# EAGLE schematic solar_collector_controller_V1.21 (EAGLE 6.5.0)
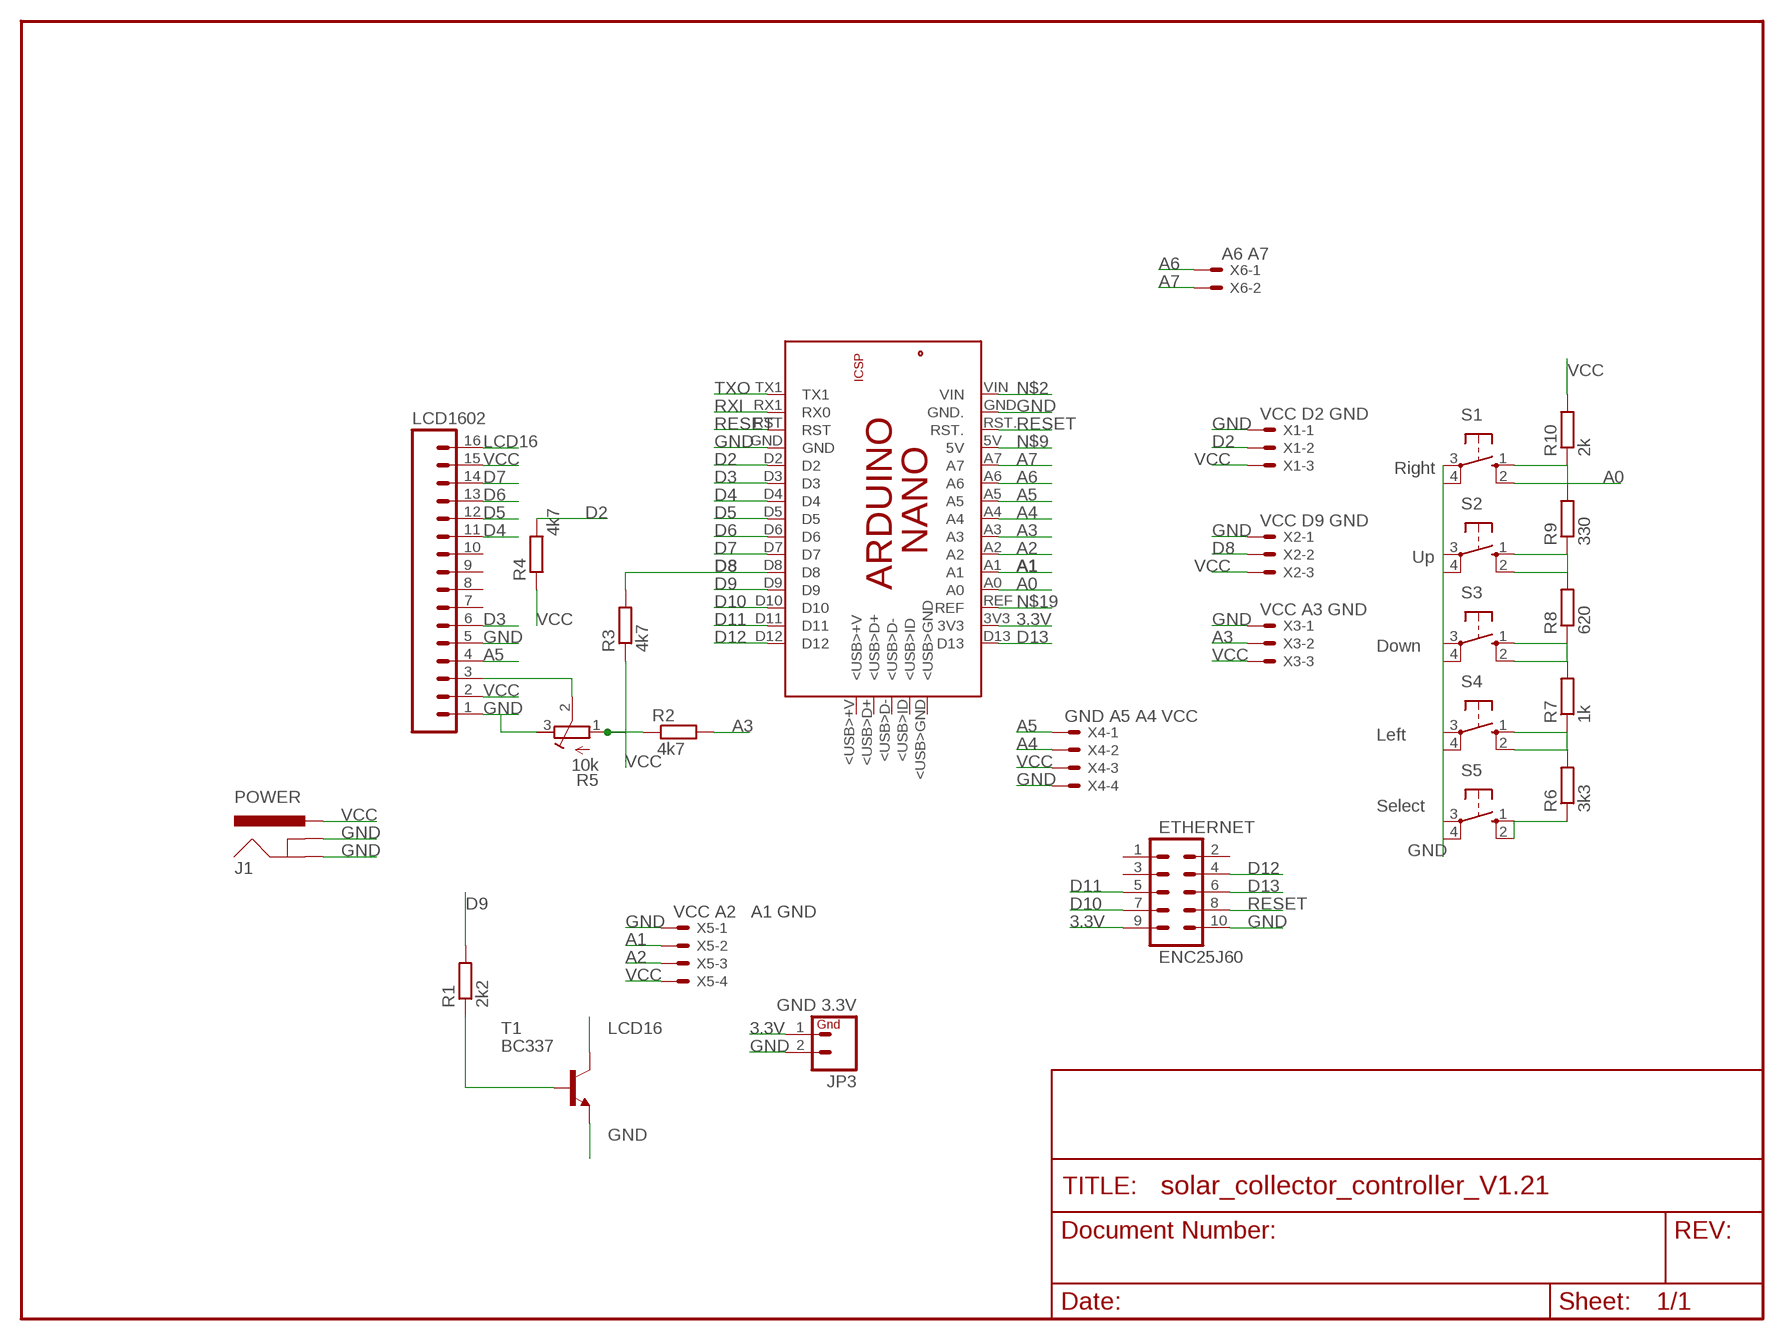
[diagram p0: schematic, sheet 1]

## Parts
ETHERNET  ENC25J60  M05X2PTH  [AVR_ICSP]
J1  POWER  POWER_JACKPTH_LOCK  [POWER_JACK_PTH_LOCK]
JP3  GND 3.3V  M02PTH  [1X02]
LCD1602  HEADER-16P-2.54  [16P-2.54]
PCB1  ARDUINO_NANO  [ARDUINO_NANO]
R1  2k2  R-EU_0207/10  [0207/10]
R2  4k7  R-EU_0207/10  [0207/10]
R3  4k7  R-EU_0207/10  [0207/10]
R4  4k7  R-EU_0207/10  [0207/10]
R5  10k  R-TRIMM64W  [RTRIM64W]
R6  3k3  R-EU_0207/10  [0207/10]
R7  1k  R-EU_0207/10  [0207/10]
R8  620  R-EU_0207/10  [0207/10]
R9  330  R-EU_0207/10  [0207/10]
R10  2k  R-EU_0207/10  [0207/10]
S1  Right  10-XX  [B3F-10XX]
S2  Up  10-XX  [B3F-10XX]
S3  Down  10-XX  [B3F-10XX]
S4  Left  10-XX  [B3F-10XX]
S5  Select  10-XX  [B3F-10XX]
T1  BC337  [TO92]
X1  VCC D2 GND  22-23-2031  [22-23-2031]
X2  VCC D9 GND  22-23-2031  [22-23-2031]
X3  VCC A3 GND  22-23-2031  [22-23-2031]
X4  GND A5 A4 VCC  22-23-2041  [22-23-2041]
X5  VCC A2 A1 GND  22-23-2041  [22-23-2041]
X6  A6 A7  22-23-2021  [22-23-2021]

## Nets
3.3V: ETHERNET.9 JP3.1 PCB1.3V3
A0: PCB1.A0 R9.2 R10.1 S1.1(S) S1.2(S1)
A1: PCB1.A1 X5.2
A2: PCB1.A2 X5.3
A3: PCB1.A3 R2.2 X3.2
A4: PCB1.A4 X4.2
A5: LCD1602.4 PCB1.A5 X4.1
A6: PCB1.A6 X6.1
A7: PCB1.A7 X6.2
D2: PCB1.D2 R4.2 X1.2
D3: LCD1602.6 PCB1.D3
D4: LCD1602.11 PCB1.D4
D5: LCD1602.12 PCB1.D5
D6: LCD1602.13 PCB1.D6
D7: LCD1602.14 PCB1.D7
D8: PCB1.D8 R3.2 X2.2
D9: PCB1.D9 R1.2
D10: ETHERNET.7 PCB1.D10
D11: ETHERNET.5 PCB1.D11
D12: ETHERNET.4 PCB1.D12
D13: ETHERNET.6 PCB1.D13
GND [vcc]: ETHERNET.10 J1.GND J1.GNDBREAK JP3.2 LCD1602.1 LCD1602.5 PCB1.GND PCB1.GND. R5.3(A) S1.3(P) S1.4(P1) S2.3(P) S2.4(P1) S3.3(P) S3.4(P1) S4.3(P) S4.4(P1) S5.3(P) S5.4(P1) T1.1(E) X1.1 X2.1 X3.1 X4.4 X5.1
LCD16: LCD1602.16 T1.3(C)
N$1: LCD1602.3 R5.2(S)
N$2: PCB1.VIN
N$4: R1.1 T1.2(B)
N$5: R6.1 S5.1(S) S5.2(S1)
N$6: R6.2 R7.1 S4.1(S) S4.2(S1)
N$8: R7.2 R8.1 S3.1(S) S3.2(S1)
N$9: PCB1.5V
N$11: R8.2 R9.1 S2.1(S) S2.2(S1)
N$19: PCB1.REF
RESET: ETHERNET.8 PCB1.RST PCB1.RST.
RXI: PCB1.RX1(RX0)
TXO: PCB1.TX1
VCC: J1.PWR LCD1602.2 LCD1602.15 R2.1 R3.1 R4.1 R5.1(E) R10.2 X1.3 X2.3 X3.3 X4.3 X5.4
Unconnected: ETHERNET.1 ETHERNET.2 ETHERNET.3 LCD1602.7 LCD1602.8 LCD1602.9 LCD1602.10 PCB1.5V. PCB1.<USB>+V PCB1.<USB>D+ PCB1.<USB>D- PCB1.<USB>GND PCB1.<USB>ID PCB1.GND_ PCB1.MISO PCB1.MOSI PCB1.RESET.. PCB1.SCK

## Library data of the parts
ETHERNET = SparkFun-Connectors:M05X2: Header 5x2 Standard 10-pin dual row 0.1" header. Commonly used with AVR-ISP. Use with Spark Fun Electronics SKU: PRT-00778
J1 = SparkFun-Connectors:POWER_JACK: Power Jack This is the standard 5.5mm barrel jack for power. The PTH is the most common, proven, reliable, footprint. The Slot footprint only works if the mill layer is transmitted to the PCB fab house so be warned. Spark Fun Electronics SKU : PRT-00119 SMT: CONN-08106 Mating wall wart : TOL-00298 (and others)
JP3 = SparkFun:M02: Header 2 Standard 2-pin 0.1" header. Use with straight break away headers (SKU : PRT-00116), right angle break away headers (PRT-00553), swiss pins (PRT-00743), machine pins (PRT-00117), and female headers (PRT-00115). Molex polarized connector foot print use with SKU : PRT-08233 with associated crimp pins and housings.
LCD1602 = Connector_seedstudio:HEADER-16P
PCB1 = E14_Arduino_published:ARDUINO_NANO: Device for representing an Arduino Nano board with a footprint in an EAGLE design. Created by Dave Young for Element14. More EAGLE documentation at: http://www.element14.com/community/community/knode/cadsoft_eagle
R1-R4 R6-R10 = resistor:R-EU_: RESISTOR, European symbol
R5 = resistor:R-TRIMM: Trimm resistor
S1-S5 = switch-omron:10-XX: OMRON SWITCH; MPN: B3F-1000; OC_FARNELL: 176432; OC_NEWARK: 36M3542
T1 = transistor:BC337: NPN TRANSISTOR
X1-X3 = con-molex:22-23-2031: .100" (2.54mm) Center Header - 3 Pin; MF: MOLEX; MPN: 22-23-2031; OC_FARNELL: 1462950; OC_NEWARK: 30C0862
X4 X5 = con-molex:22-23-2041: .100" (2.54mm) Center Header - 4 Pin; MF: MOLEX; MPN: 22-23-2041; OC_FARNELL: 1462920; OC_NEWARK: 38C0355
X6 = con-molex:22-23-2021: .100" (2.54mm) Center Header - 2 Pin; MF: MOLEX; MPN: 22-23-2021; OC_FARNELL: 1462926; OC_NEWARK: 25C3832

## Net classes
0 default: width 0.203 mm
1 vcc: width 0.254 mm